# EAGLE design AVES_Telemetria_Eagle (EAGLE 9.5.2)
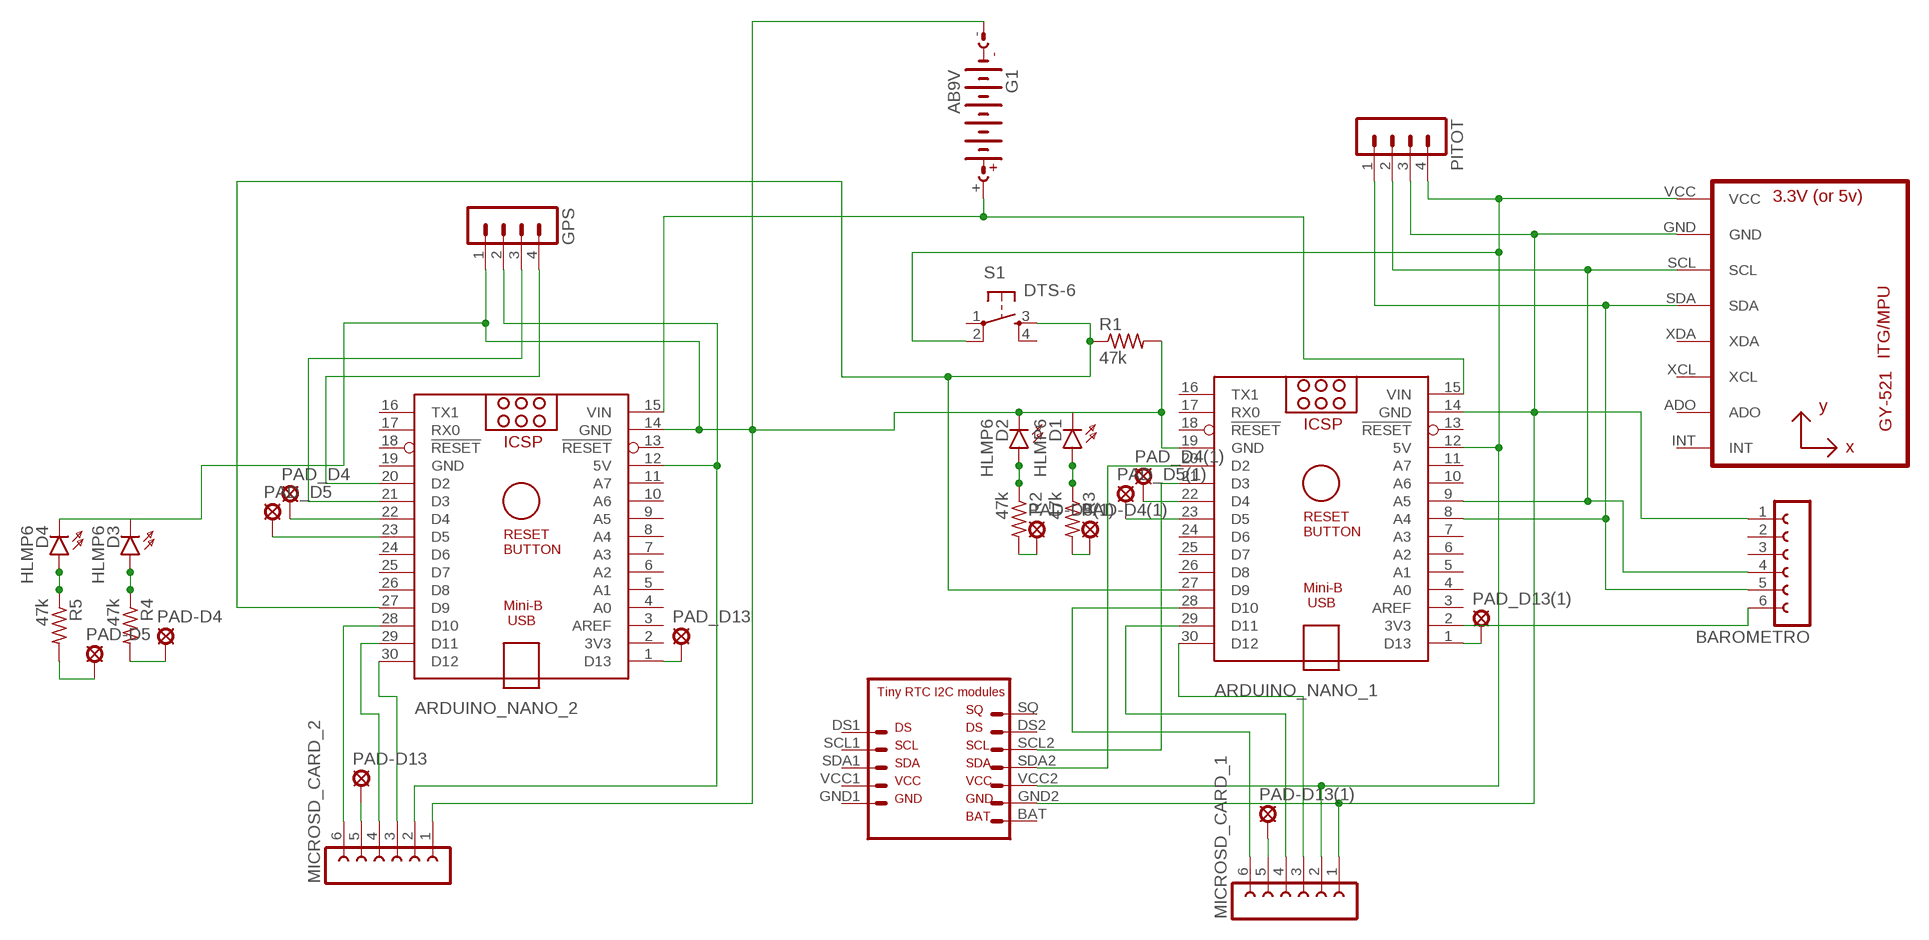
[diagram p0: schematic, sheet 1]

## Parts
ARDUINO_NANO_1  ARDUINO_NANO  [ARDUINO_NANO]
ARDUINO_NANO_2  ARDUINO_NANO  [ARDUINO_NANO]
BAROMETRO  FE06-1  [FE06]
D1  HLMP6  [HLMP6]
D2  HLMP6  [HLMP6]
D3  HLMP6  [HLMP6]
D4  HLMP6  [HLMP6]
G1  AB9V  [AB9V]
GPS  MA04-1  [MA04-1]
MICROSD_CARD_1  FE06-1  [FE06]
MICROSD_CARD_2  FE06-1  [FE06]
PAD-D4  LSP10  [LSP10]
PAD-D4(1)  LSP10  [LSP10]
PAD-D5  LSP10  [LSP10]
PAD-D5(1)  LSP10  [LSP10]
PAD-D13  LSP10  [LSP10]
PAD-D13(1)  LSP10  [LSP10]
PAD_D4  LSP10  [LSP10]
PAD_D4(1)  LSP10  [LSP10]
PAD_D5  LSP10  [LSP10]
PAD_D5(1)  LSP10  [LSP10]
PAD_D13  LSP10  [LSP10]
PAD_D13(1)  LSP10  [LSP10]
PITOT  MA04-1  [MA04-1]
R1  47k  R-US_0204/5  [0204/5]
R2  47k  R-US_0204/5  [0204/5]
R3  47k  R-US_0204/5  [0204/5]
R4  47k  R-US_0204/5  [0204/5]
R5  47k  R-US_0204/5  [0204/5]
S1  DTS-6  [DTS-6]
U1  GY-521MPU6050  [GY-521]
U$1  RTC  [RTC]

## Nets
N$2: D1.A R3.1
N$3: PAD-D4(1).MP R3.2
N$4: D2.A R2.1
N$5: ARDUINO_NANO_1.23(D5) PAD_D5(1).MP
N$6: ARDUINO_NANO_1.27(D9) ARDUINO_NANO_2.27(D9) R1.1 S1.3
N$7: ARDUINO_NANO_1.12(5V) MICROSD_CARD_1.2 PITOT.4 S1.2 U1.VCC U$1.VCC2
N$8: ARDUINO_NANO_1.15(VIN) ARDUINO_NANO_2.15(VIN) G1.+
N$9: ARDUINO_NANO_1.20(D2) U$1.SDA2
N$10: ARDUINO_NANO_1.21(D3) U$1.SCL2
N$11: ARDUINO_NANO_1.8(A4) BAROMETRO.5 PITOT.1 U1.SDA
N$12: ARDUINO_NANO_1.9(A5) BAROMETRO.4 PITOT.2 U1.SCL
N$13: ARDUINO_NANO_1.2(3V3) BAROMETRO.6
N$14: ARDUINO_NANO_1.28(D10) MICROSD_CARD_1.6
N$15: MICROSD_CARD_1.5 PAD-D13(1).MP
N$16: ARDUINO_NANO_1.29(D11) MICROSD_CARD_1.4
N$17: ARDUINO_NANO_1.30(D12) MICROSD_CARD_1.3
N$18: ARDUINO_NANO_1.19(GND) ARDUINO_NANO_2.14(GND) D1.K D2.K D3.K D4.K G1.- GPS.1 MICROSD_CARD_2.1 R1.2
N$19: ARDUINO_NANO_2.12(5V) GPS.2 MICROSD_CARD_2.2
N$20: ARDUINO_NANO_2.21(D3) GPS.3
N$21: ARDUINO_NANO_2.20(D2) GPS.4
N$22: PAD-D4.MP R4.2
N$23: ARDUINO_NANO_2.22(D4) PAD_D4.MP
N$24: ARDUINO_NANO_2.30(D12) MICROSD_CARD_2.3
N$25: ARDUINO_NANO_2.29(D11) MICROSD_CARD_2.4
N$26: MICROSD_CARD_2.5 PAD-D13.MP
N$27: ARDUINO_NANO_2.28(D10) MICROSD_CARD_2.6
N$28: ARDUINO_NANO_2.23(D5) PAD_D5.MP
N$29: D3.A R4.1
N$30: PAD-D5.MP R5.2
N$31: D4.A R5.1
N$32: ARDUINO_NANO_1.22(D4) PAD_D4(1).MP
N$33: PAD-D5(1).MP R2.2
N$34: ARDUINO_NANO_2.1(D13) PAD_D13.MP
N$35: ARDUINO_NANO_1.1(D13) PAD_D13(1).MP
N$36: ARDUINO_NANO_1.14(GND) BAROMETRO.1 MICROSD_CARD_1.1 PITOT.3 U1.GND U$1.GND2
Unconnected: ARDUINO_NANO_1.3(AREF) ARDUINO_NANO_1.4(A0) ARDUINO_NANO_1.5(A1) ARDUINO_NANO_1.6(A2) ARDUINO_NANO_1.7(A3) ARDUINO_NANO_1.10(A6) ARDUINO_NANO_1.11(A7) ARDUINO_NANO_1.13(!RESET) ARDUINO_NANO_1.16(TX1) ARDUINO_NANO_1.17(RX0) ARDUINO_NANO_1.18(!RESET) ARDUINO_NANO_1.24(D6) ARDUINO_NANO_1.25(D7) ARDUINO_NANO_1.26(D8) ARDUINO_NANO_2.2(3V3) ARDUINO_NANO_2.3(AREF) ARDUINO_NANO_2.4(A0) ARDUINO_NANO_2.5(A1) ARDUINO_NANO_2.6(A2) ARDUINO_NANO_2.7(A3) ARDUINO_NANO_2.8(A4) ARDUINO_NANO_2.9(A5) ARDUINO_NANO_2.10(A6) ARDUINO_NANO_2.11(A7) ARDUINO_NANO_2.13(!RESET) ARDUINO_NANO_2.16(TX1) ARDUINO_NANO_2.17(RX0) ARDUINO_NANO_2.18(!RESET) ARDUINO_NANO_2.24(D6) ARDUINO_NANO_2.25(D7) ARDUINO_NANO_2.26(D8) BAROMETRO.2 BAROMETRO.3 S1.1 S1.4 U1.ADO U1.INT U1.XCL U1.XDA U$1.BAT U$1.DS1 U$1.DS2 U$1.GND1 U$1.SCL1 U$1.SDA1 U$1.SQ U$1.VCC1

## Power pins joined to a net without a drawn wire
GND: ARDUINO_NANO_2.19(GND)

## Library data of the parts
ARDUINO_NANO_1 ARDUINO_NANO_2 = ArduinoNanoV30:ARDUINO_NANO: Arduino Nano V3.0 Overview: The Arduino Nano is a small, complete, and breadboard-friendly board based on the ATmega328 (Arduino Nano 3.x) or ATmega168 (Arduino Nano 2.x). It has more or less the same functionality of the Arduino Duemilanove, but in a different package. It lacks only a DC power jack, and works with a Mini-B USB cable instead of a standard one. The Nano was designed and is being produced by Gravitech. Specifications: Microcontroller Atmel ATmega168 or ATmega328 Operating Voltage (logic level) 5 V Input Voltage (recommended) 7-12 V Input Voltage (limits) 6-20 V Digital I/O Pins 14 (of which 6 provide PWM output) Analog Input Pins 8 DC Current per I/O Pin 40 mA Flash Memory 16 KB (ATmega168) or 32 KB (ATmega328) of which 2 KB used by bootloader SRAM 1 KB (ATmega168) or 2 KB (ATmega328) EEPROM 512 bytes (ATmega168) or 1 KB (ATmega328) Clock Speed 16 MHz Dimensions 0.73" x 1.70" Length 45 mm Width 18 mm Weigth 5 g Power: The Arduino Nano can be powered via the Mini-B USB connection, 6-20V unregulated external power supply (pin 30), or 5V regulated external power supply (pin 27). The power source is automatically selected to the highest voltage source. Memory: The ATmega168 has 16 KB of flash memory for storing code (of which 2 KB is used for the bootloader); the ATmega328 has 32 KB, (also with 2 KB used for the bootloader). The ATmega168 has 1 KB of SRAM and 512 bytes of EEPROM (which can be read and written with the EEPROM library); the ATmega328 has 2 KB of SRAM and 1 KB of EEPROM. Input and Output: Each of the 14 digital pins on the Nano can be used as an input or output, using pinMode(), digitalWrite(), and digitalRead() functions. They operate at 5 volts. Each pin can provide or receive a maximum of 40 mA and has an internal pull-up resistor (disconnected by default) of 20-50 kOhms. In addition, some pins have specialized functions. Visit Arduino - ArduinoBoardNano <https://www.arduino.cc/en/Main/ArduinoBoardNano>
BAROMETRO MICROSD_CARD_1 MICROSD_CARD_2 = con-lsta:FE06-1: FEMALE HEADER; OC_FARNELL: unknown; OC_NEWARK: unknown
D1-D4 = display-hp:HLMP6: LED 2mm horizontal; MF: AGILENT TECHNOLOGIES; MPN: HLMP-6500; OC_FARNELL: 1652490; OC_NEWARK: 40K0088
G1 = battery:AB9V: 9-V BATTERY CLIP
GPS PITOT = con-lstb:MA04-1: PIN HEADER; OC_FARNELL: unknown; OC_NEWARK: unknown
PAD-D4 PAD-D4(1) PAD-D5 PAD-D5(1) PAD-D13 PAD-D13(1) PAD_D4 PAD_D4(1) PAD_D5 PAD_D5(1) PAD_D13 PAD_D13(1) = solpad:LSP10: SOLDER PAD drill 1.0 mm, distributor Buerklin, 12H555
R1-R5 = rcl:R-US_: RESISTOR, American symbol; SPICEPREFIX: R
S1 = switch-tact:DTS-6
U1 = gy-521:GY-521
U$1 = RTC:RTC

## Board
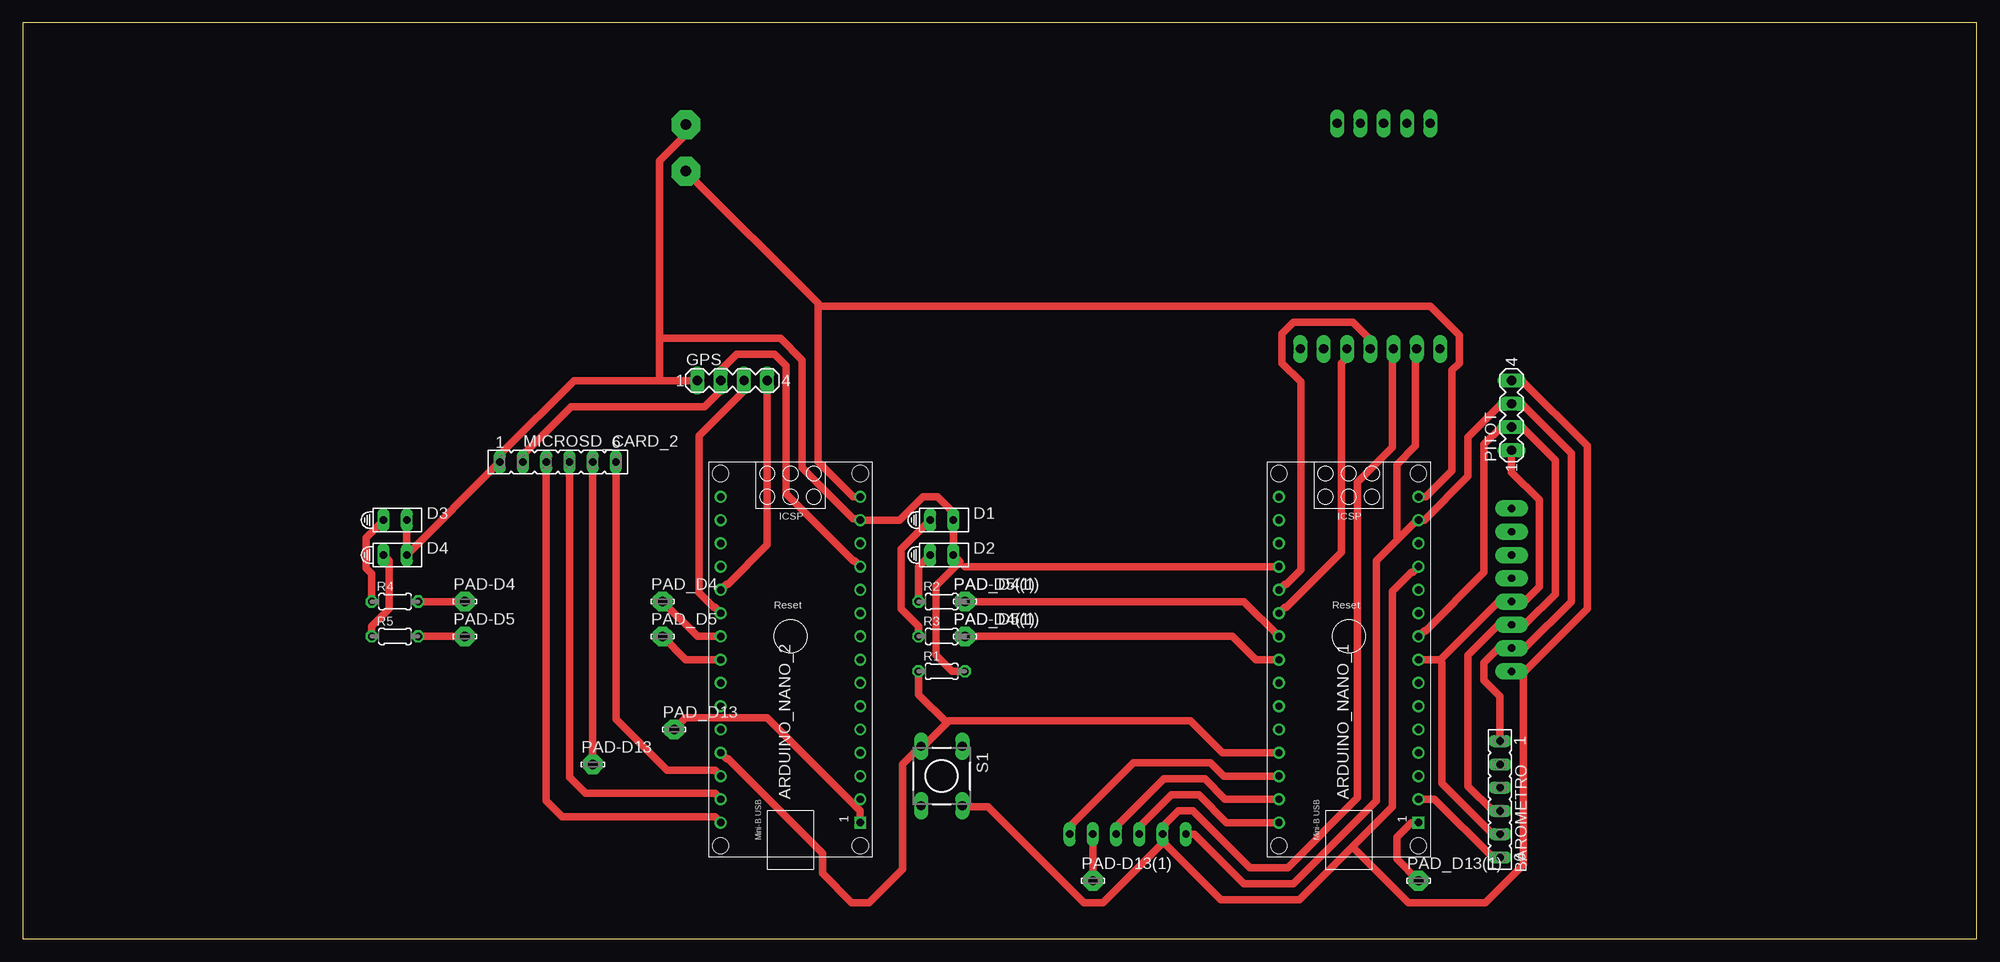
[diagram p1: board, top side]
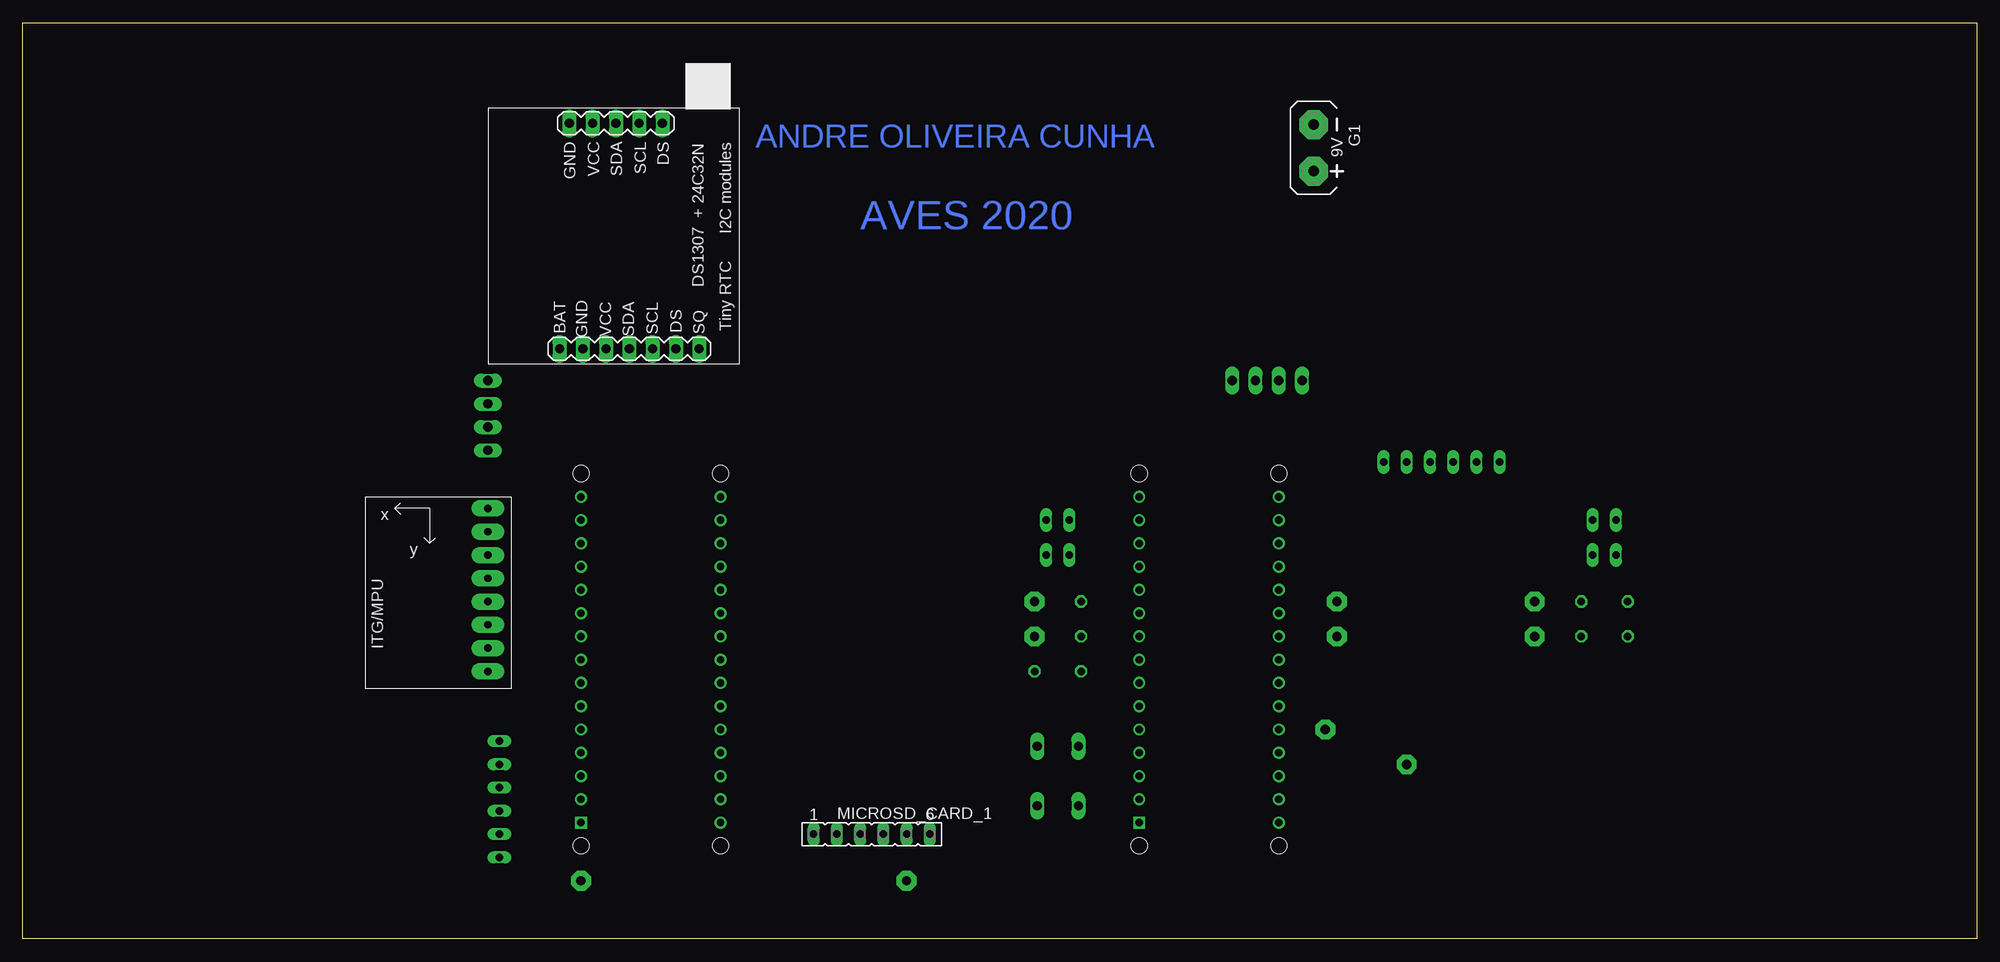
[diagram p2: board, bottom side, seen from below]

Size 213.34 x 100 mm. Coordinates in mm from the lower left corner, seen from the top.
Outline: 0,0 213.34,0 213.34,100 0,100 0,0
Copper layers (1*16): Top 0.035mm / dielectric 1.5mm / Bottom 0.035mm
Design rules "default *": minimum track width 32mil, minimum drill 0.35mm, track to track 32mil, track to pad 32mil, pad to pad 32mil, via to via 32mil, smd to smd 6mil, copper to edge 40mil, drill to drill 32mil, minimum pad ring 10mil, minimum via ring 8mil, stop-mask expansion 4mil, vias tented up to drill 0mil, thermal gap 10mil

### Footprints (pad centres in the part's own frame; a part is rotated, then mirrored left to right if it is on the bottom)
ARDUINO_NANO = drill 0.8 square: 1 -20.32,-7.62 | drill 0.8: 2 -17.78,-7.62; 3 -15.24,-7.62; 4 -12.7,-7.62; 5 -10.16,-7.62; 6 -7.62,-7.62; 7 -5.08,-7.62; 8 -2.54,-7.62; 9 0,-7.62; 10 2.54,-7.62; 11 5.08,-7.62; 12 7.62,-7.62; 13 10.16,-7.62; 14 12.7,-7.62; 15 15.24,-7.62; 16 15.24,7.62; 17 12.7,7.62; 18 10.16,7.62; 19 7.62,7.62; 20 5.08,7.62; 21 2.54,7.62; 22 0,7.62; 23 -2.54,7.62; 24 -5.08,7.62; 25 -7.62,7.62; 26 -10.16,7.62; 27 -12.7,7.62; 28 -15.24,7.62; 29 -17.78,7.62; 30 -20.32,7.62 | hole 1.778: -22.86,-7.62; -22.86,7.62; 17.78,7.62; 17.78,-7.62
FE06 = drill 0.813 long: 1 -6.35,0; 2 -3.81,0; 3 -1.27,0; 4 1.27,0; 5 3.81,0; 6 6.35,0
HLMP6 = drill 0.813 long: A -1.27,0; K 1.27,0
AB9V = drill 1.118 pad 3.15 octagon: + 0,2.54; - 0,-2.54
MA04-1 = drill 1.016 long: 1 -3.81,0; 2 -1.27,0; 3 1.27,0; 4 3.81,0
LSP10 = drill 1.016 pad 2.159 octagon: MP 0,0
0204/5 = drill 0.813 octagon: 1 -2.54,0; 2 2.54,0
DTS-6 = drill 1 long: 1 -3.25,2.25; 2 3.25,2.25; 3 -3.25,-2.25; 4 3.25,-2.25
GY-521 = drill 0.8 pad 1.778 long: ADO -8.89,-6.35; GND -8.89,6.35; INT -8.89,-8.89; SCL -8.89,3.81; SDA -8.89,1.27; VCC -8.89,8.89; XCL -8.89,-3.81; XDA -8.89,-1.27
RTC = drill 1.016 long: BAT 25.75,7.82; DS1 1.13,19.05; DS2 25.75,20.52; GND1 1.13,8.89; GND2 25.75,10.36; SCL1 1.13,16.51; SCL2 25.75,17.98; SDA1 1.13,13.97; SDA2 25.75,15.44; SQ 25.75,23.06; VCC1 1.13,11.43; VCC2 25.75,12.9

### Placement (x,y rotation side)
ARDUINO_NANO_1  144.78,33.02 90 top
ARDUINO_NANO_2  83.82,33.02 90 top
BAROMETRO  161.29,15.24 270 top
D1  100.33,45.72 0 top
D2  100.33,41.91 0 top
D3  40.64,45.72 0 top
D4  40.64,41.91 0 top
G1  72.39,86.36 180 bottom
GPS  77.47,60.96 0 top
MICROSD_CARD_1  120.65,11.43 0 bottom
MICROSD_CARD_2  58.42,52.07 0 top
PAD-D4  48.26,36.83 0 top
PAD-D4(1)  102.87,33.02 0 top
PAD-D5  48.26,33.02 0 top
PAD-D5(1)  102.87,36.83 0 top
PAD-D13  62.23,19.05 0 top
PAD-D13(1)  116.84,6.35 0 top
PAD_D4  69.85,36.83 0 top
PAD_D4(1)  102.87,36.83 0 top
PAD_D5  69.85,33.02 0 top
PAD_D5(1)  102.87,33.02 0 top
PAD_D13  71.12,22.86 0 top
PAD_D13(1)  152.4,6.35 0 top
PITOT  162.56,57.15 90 top
R1  100.33,29.21 0 top
R2  100.33,36.83 0 top
R3  100.33,33.02 0 top
R4  40.64,36.83 0 top
R5  40.64,33.02 0 top
S1  100.33,17.78 270 top
U1  171.45,38.1 180 bottom
U$1  162.56,90.17 270 bottom

### Tracks (layer width: path | path; a pad name or v marks a point on that pad's centre or on a via)
N$2
  Top 0.813: R3.1 97.79,34.13 95.89,36.04 95.89,42.55 D1.A
N$4
  Top 0.813: R2.1 97.79,40.64 D2.A
N$5
  Top 0.813: ARDUINO_NANO_1.23 134.62,30.48 132.08,33.02 PAD_D5(1).MP
N$6
  Top 0.813: ARDUINO_NANO_2.27 76.83,19.68 76.99,19.68 87.31,9.37 87.31,7.14 90.49,3.97 92.39,3.97 96.04,7.62 96.04,19.05 97.95,20.95 S1.3 98.42,21.11 100.89,23.57 97.79,26.67 R1.1 | ARDUINO_NANO_1.27 130.97,20.32 127.48,23.81 101.12,23.81
N$7
  Top 0.813: PITOT.4 163.67,60.96 170.81,53.82 170.81,36.04 163.99,29.21 U1.VCC 163.83,28.89 163.83,8.1 159.7,3.97 151.29,3.97 145.18,10.08 | ARDUINO_NANO_1.12 151.76,40.01 151.61,40.01 149.54,37.94 149.54,14.45 145.18,10.08 | 145.18,10.08 139.38,4.29 130.81,4.29 124.46,10.64 MICROSD_CARD_1.2 | S1.2 102.71,14.45 105.41,14.45 115.89,3.97 117.95,3.97 124.3,10.32 MICROSD_CARD_1.2 | U$1.VCC2 149.54,64.29 149.54,53.66 145.73,49.85 145.73,15.4 138.11,7.78 133.99,7.78 127.79,13.97 126.21,13.97 124.62,12.38 124.62,11.75 MICROSD_CARD_1.2
N$8
  Top 0.813: ARDUINO_NANO_2.15 90.65,48.26 86.84,52.07 86.84,69.06 | 86.84,69.06 86.84,69.37 G1.+ | ARDUINO_NANO_1.15 153.19,48.26 156.05,51.12 156.05,62.07 156.84,62.87 156.84,65.88 153.67,69.06 86.84,69.06
N$9
  Top 0.813: ARDUINO_NANO_1.20 137.79,38.73 137.95,38.73 139.54,40.32 139.54,60.8 137.48,62.87 137.48,66.04 138.75,67.31 145.26,67.31 147,65.56 147,64.45 U$1.SDA2
N$10
  Top 0.813: ARDUINO_NANO_1.21 137.79,36.2 137.95,36.2 143.99,42.23 143.99,62.87 144.46,63.34 144.46,64.29 U$1.SCL2
N$11
  Top 0.813: 154.78,30.48 ARDUINO_NANO_1.8 | 154.78,30.48 161.13,36.83 U1.SDA 162.88,36.99 164.15,36.99 165.58,38.42 165.58,47.94 162.56,50.96 PITOT.1 | BAROMETRO.5 160.5,11.43 154.94,16.99 154.94,30.16 154.78,30.48
N$12
  Top 0.813: BAROMETRO.4 160.5,13.97 157.8,16.67 157.8,30.96 161.13,34.29 U1.SCL 162.88,34.45 164.15,34.45 167.32,37.62 167.32,52.23 163.83,55.72 162.88,55.72 PITOT.2 161.45,55.88 159.54,53.98 159.54,40.01 153.19,33.66 153.03,33.66 ARDUINO_NANO_1.9
N$13
  Top 0.813: ARDUINO_NANO_1.2 154.15,15.24 160.5,8.89 BAROMETRO.6
N$14
  Top 0.813: ARDUINO_NANO_1.28 131.13,17.78 129.7,19.21 121.28,19.21 114.3,12.22 MICROSD_CARD_1.6
N$15
  Top 0.813: PAD-D13(1).MP MICROSD_CARD_1.5
N$16
  Top 0.813: ARDUINO_NANO_1.29 131.29,15.24 129.06,17.46 124.62,17.46 119.38,12.22 MICROSD_CARD_1.4
N$17
  Top 0.813: ARDUINO_NANO_1.30 131.44,12.7 128.43,15.72 125.41,15.72 121.92,12.22 MICROSD_CARD_1.3
N$18
  Top 0.813: 102.87,40.64 ARDUINO_NANO_1.19 | R1.2 101.44,29.21 99.69,30.96 99.69,38.58 102.31,41.2 D2.K D1.K 101.6,46.51 99.85,48.26 98.27,48.26 95.73,45.72 ARDUINO_NANO_2.14 91.12,45.88 90.65,45.88 85.09,51.44 85.09,63.18 82.71,65.56 69.53,65.56 | D3.K D4.K MICROSD_CARD_2.1 52.23,52.39 52.23,53.02 60.17,60.96 69.53,60.96 | 69.53,60.96 GPS.1 | G1.- 72.39,87.79 69.53,84.93 69.53,65.56 | 69.53,60.96 69.53,65.56
N$19
  Top 0.813: ARDUINO_NANO_2.12 90.81,41.27 90.65,41.27 83.34,48.58 83.34,62.55 82.07,63.82 77.95,63.82 76.2,62.07 GPS.2 76.04,60.64 76.04,59.69 74.45,58.1 59.85,58.1 54.61,52.86 MICROSD_CARD_2.2
N$20
  Top 0.813: ARDUINO_NANO_2.21 75.56,36.2 75.41,36.2 73.82,37.78 73.82,54.93 78.74,59.85 GPS.3
N$21
  Top 0.813: ARDUINO_NANO_2.20 76.83,38.73 76.99,38.73 81.28,43.02 GPS.4
N$22
  Top 0.813: PAD-D4.MP R4.2
N$23
  Top 0.813: ARDUINO_NANO_2.22 73.66,33.02 PAD_D4.MP
N$24
  Top 0.813: ARDUINO_NANO_2.30 75.56,13.34 58.9,13.34 57.15,15.08 MICROSD_CARD_2.3
N$25
  Top 0.813: ARDUINO_NANO_2.29 75.56,15.88 61.44,15.88 59.69,17.62 MICROSD_CARD_2.4
N$26
  Top 0.813: PAD-D13.MP MICROSD_CARD_2.5
N$27
  Top 0.813: ARDUINO_NANO_2.28 75.56,18.41 70.33,18.41 64.77,23.97 MICROSD_CARD_2.6
N$28
  Top 0.813: ARDUINO_NANO_2.23 72.39,30.48 PAD_D5.MP
N$29
  Top 0.813: R4.1 38.1,39.85 37.47,40.48 37.47,43.81 D3.A
N$30
  Top 0.813: PAD-D5.MP R5.2
N$31
  Top 0.813: R5.1 38.1,34.13 40.01,36.04 40.01,41.27 D4.A
N$32
  Top 0.813: PAD_D4(1).MP 133.35,36.83 ARDUINO_NANO_1.22
N$34
  Top 0.813: PAD_D13.MP 72.39,24.13 81.28,24.13 91.44,13.97 ARDUINO_NANO_2.1
N$35
  Top 0.813: ARDUINO_NANO_1.1 151.61,12.7 150.02,11.11 150.02,8.73 PAD_D13(1).MP
N$36
  Top 0.813: BAROMETRO.1 161.29,26.51 159.54,28.26 159.54,30.16 161.13,31.75 U1.GND 162.88,31.91 164.15,31.91 169.07,36.83 169.07,53.02 163.83,58.26 162.88,58.26 PITOT.3 161.45,58.42 157.8,54.77 157.8,50.48 153.03,45.72 ARDUINO_NANO_1.14 152.08,45.56 150.26,43.74 | MICROSD_CARD_1.1 127.95,11.43 133.35,6.03 138.75,6.03 147.8,15.08 147.8,41.27 150.26,43.74 | U$1.GND2 152.08,64.29 152.08,53.82 150.02,51.75 150.02,43.97 150.26,43.74

### Text on the board
Bottom: ANDRE OLIVEIRA CUNHA | AVES 2020